# Altium schematic sheet O2 level.SchDoc
size A4; SheetNumber: 1; SheetTotal: 1
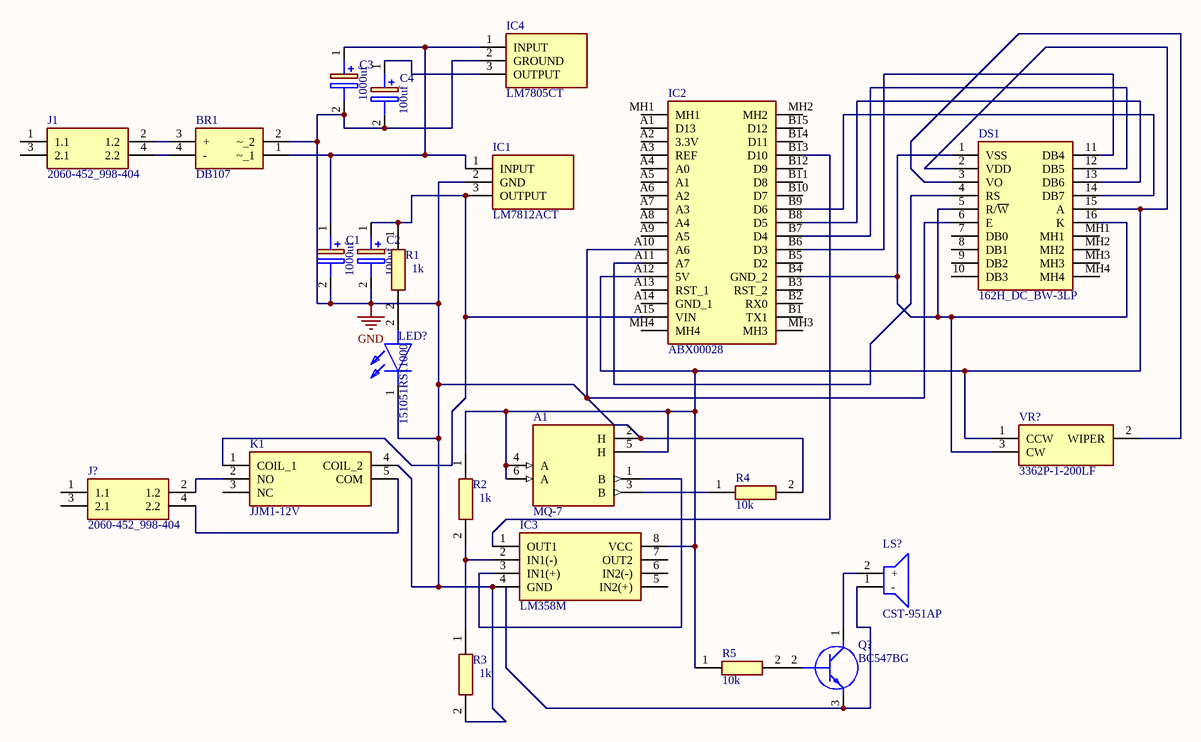
[diagram p0: O2 level.SchDoc]

## Parts
A1  MQ-7  [XDCR_MQ-7]
BR1  DB107  [DIP825W50P510L830H340Q4N]
C1  1000uf  [CAPPRD550W60D1050H2150]
C2  100uf  [CAPPRD500W65D1000H3200]
C3  1000uf  [CAPPRD550W60D1050H2150]
C4  100uf  [CAPPRD500W65D1000H3200]
DS1  162H_DC_BW-3LP  [162HDCBW3LP]
IC1  LM7812ACT  [TO254P470X1016X2019-3P]
IC2  ABX00028  [ABX00028]
IC3  LM358M  [SOIC127P600X175-8N]
IC4  LM7805CT  [TO254P470X1028X1955-3P]
J1  2060-452_998-404  [2060452998404]
J?  2060-452_998-404  [2060452998404]
K1  JJM1-12V  [JJM112V]
LED?  151051RS11000  [151051RS11000]
LS?  CST-951AP  [CST951AP]
Q?  BC547BG  [TO-92_(TO-226)]
R1  1k  [RESAD1987W56L1031D239]
R2  1k  [RESAD1987W56L1031D239]
R3  1k  [RESAD1987W56L1031D239]
R4  10k  [RESAD1987W56L1031D239]
R5  10k  [RESAD1987W56L1031D239]
VR?  3362P-1-200LF  [3362P1200LF]

## Nets
GND: A1.2(H) BR1.2(~_2) C1.2(-) C2.2(-) C3.2(-) C4.2(-) DS1.6(E) IC1.2(GND) IC2.A10(A6) IC3.4(GND) IC4.2(GROUND) K1.4(COIL_2) LED?.1(K) R3.2 R4.2
NetA1_1: A1.1(B) IC3.3(IN1(+))
NetA1_3: A1.3(B) R4.1
NetA1_4: A1.4(A) A1.5(H) A1.6(A) DS1.2(VDD) DS1.15(A) IC2.A12(5V) IC3.8(VCC) R2.1 R5.1 VR?.1(CCW)
NetBR1_1: BR1.1(~_1) C1.1(+) C3.1(+) IC1.1(INPUT) IC4.1(INPUT)
NetBR1_3: BR1.3(+) J1.2(1.2)
NetBR1_4: BR1.4(-) J1.4(2.2)
NetC2_1: C2.1(+) IC1.3(OUTPUT) IC2.A15(VIN) K1.1(COIL_1) R1.1
NetC4_1: C4.1(+) IC4.3(OUTPUT)
NetDS1_1: DS1.1(VSS) DS1.5(R/~{W}) DS1.16(K) IC2.B4(GND_2) VR?.3(CW)
NetDS1_3: DS1.3(VO) VR?.2(WIPER)
NetDS1_4: DS1.4(RS) IC2.A11(A7)
NetDS1_11: DS1.11(DB4) IC2.B6(D3)
NetDS1_12: DS1.12(DB5) IC2.B7(D4)
NetDS1_13: DS1.13(DB6) IC2.B8(D5)
NetDS1_14: DS1.14(DB7) IC2.B9(D6)
NetIC2_B13: IC2.B13(D10) IC3.1(OUT1)
NetIC3_2: IC3.2(IN1(-)) R2.2 R3.1
NetJ?_2: J?.2(1.2) K1.2(NO)
NetJ?_4: J?.4(2.2) K1.5(COM)
NetLED?_2: LED?.2(A) R1.2
NetLS?_1: LS?.1(-) Q?.3(E)
NetLS?_2: LS?.2(+) Q?.1(C)
NetQ?_2: Q?.2(B) R5.2

Not connected (* = marked no-connect by the designer): DS1 7(DB0) 8(DB1) 9(DB2) 10(DB3) MH1 MH2 MH3 MH4; IC2 A1(D13) A2(3.3V) A3(REF) A4(A0) A5(A1) A6(A2) A7(A3) A8(A4) A9(A5) A13(RST_1) A14(GND_1) B1(TX1) B2(RX0) B3(RST_2) B5(D2) B10(D7) B11(D8) B12(D9) B14(D11) B15(D12) MH1 MH2 MH3 MH4; IC3 5(IN2(+)) 6(IN2(-)) 7(OUT2); J1 1(1.1) 3(2.1); J? 1(1.1) 3(2.1); K1 3(NC)

## Library data of the parts
A1 = MQ-7: Gas Sensor, High sensitivity to carbon monoxide; MF: Hanwei Electronics Co., Ltd; Price: None; Availability: Unavailable; MP: MQ-7; Package: Package; SnapEDA_Link: https://www.snapeda.com/parts/MQ-7/Hanwei%20Electronics%20Co.,%20Ltd/view-part/5661821/?ref=snap; Check_prices: https://www.snapeda.com/parts/MQ-7/Hanwei%20Electronics%20Co.,%20Ltd/view-part/5661821/?ref=eda; Value: *
BR1 = DB107: Bridge Rectifier; Manufacturer_Name: Rectron; Datasheet Link: https://www.rectron.com/data_sheets/db101-107.pdf; Height: 3.4mm; Manufacturer_Part_Number: DB107; Mouser Part Number: 583-DB107; Mouser Price/Stock: https://www.mouser.co.uk/ProductDetail/Rectron/DB107?qs=G5AQjGfRJcLGAY%252B6bEDnbw%3D%3D
C1 C3 = 108CKE025M: Capacitor Polarised; Manufacturer_Name: Cinch Connectivity Solutions; Datasheet Link: https://componentsearchengine.com/Datasheets/2/108CKE025M.pdf; Height: 21.5mm; Manufacturer_Part_Number: 108CKE025M
C2 C4 = EEU-FC2A101L: Capacitor Polarised; Manufacturer_Name: Panasonic; Datasheet Link: http://industrial.panasonic.com/cdbs/www-data/pdf/RDF0000/ABA0000C1209.pdf; Height: 32mm; Manufacturer_Part_Number: EEU-FC2A101L; Mouser Part Number: 667-EEU-FC2A101L; Mouser Price/Stock: https://www.mouser.co.uk/ProductDetail/Panasonic/EEU-FC2A101L?qs=MtOUKumLmnYYrYsMGpDvcw%3D%3D; Arrow Part Number: EEU-FC2A101L; Arrow Price/Stock: https://www.arrow.com/en/products/eeu-fc2a101l/panasonic?region=nac
DS1 = 162H_DC_BW-3LP: Display; Manufacturer_Name: Displaytech; Manufacturer_Part_Number: 162H DC BW-3LP; Datasheet Link: https://www.mouser.com/datasheet/2/1015/162H-DC-BW-3LP-Displaytech-Spec-1664822.pdf; Height: 13.2mm; Mouser Part Number: 758-162HDCBW3LP; Mouser Price/Stock: https://www.mouser.co.uk/ProductDetail/Displaytech/162H-DC-BW-3LP?qs=PzGy0jfpSMu9Pu07wP3dWg%3D%3D
IC1 = LM7812ACT: Integrated Circuit; Manufacturer_Name: onsemi; Datasheet Link: https://datasheet.datasheetarchive.com/originals/distributors/Datasheets_SAMA/704b005d7d2d9ced5864f40b6609c1bc.pdf; Height: 4.7mm; Manufacturer_Part_Number: LM7812ACT; Mouser Part Number: 512-LM7812ACT; Mouser Price/Stock: https://www.mouser.com/Search/Refine.aspx?Keyword=512-LM7812ACT; Arrow Part Number: LM7812ACT; Arrow Price/Stock: https://www.arrow.com/en/products/lm7812act/on-semiconductor
IC2 = ABX00028: Integrated Circuit; Manufacturer_Name: Arduino; Datasheet Link: https://store.arduino.cc/arduino-nano-every; Height: 10mm; Manufacturer_Part_Number: ABX00028; Mouser Part Number: 782-ABX00028; Mouser Price/Stock: https://www.mouser.co.uk/ProductDetail/Arduino/ABX00028?qs=PzGy0jfpSMtit6rnFl8mVg%3D%3D; Arrow Part Number: ABX00028; Arrow Price/Stock: https://www.arrow.com/en/products/abx00028/arduino-corporation?region=nac
IC3 = LM358M: Integrated Circuit; Manufacturer_Name: onsemi; Datasheet Link: https://www.onsemi.com/pub/Collateral/LM358A-D.pdf; Height: 1.75mm; Manufacturer_Part_Number: LM358M; Mouser Part Number: 512-LM358M; Mouser Price/Stock: https://www.mouser.co.uk/ProductDetail/onsemi-Fairchild/LM358M?qs=M37yUtvuNLzx7IpRziQN1g%3D%3D; Arrow Part Number: LM358M; Arrow Price/Stock: https://www.arrow.com/en/products/lm358m/on-semiconductor
IC4 = LM7805CT: Integrated Circuit; Manufacturer_Name: Texas Instruments; Datasheet Link: http://www.ti.com/lit/ds/symlink/lm340.pdf; Height: 4.7mm; Manufacturer_Part_Number: LM7805CT; Mouser Part Number: 926-LM7805CT; Mouser Price/Stock: https://www.mouser.co.uk/ProductDetail/Texas-Instruments/LM7805CT?qs=QbsRYf82W3EaqXeMDVwIfQ%3D%3D; Arrow Part Number: LM7805CT; Arrow Price/Stock: https://www.arrow.com/en/products/lm7805ct/texas-instruments?region=europe
J1 J? = 2060-452_998-404: Connector; Manufacturer_Name: Wago; Manufacturer_Part_Number: 2060-452/998-404; Datasheet Link: https://www.wago.com/2060-452/998-404; Height: 4.5mm; Arrow Part Number: 2060-452/998-404; Arrow Price/Stock: https://www.arrow.com/en/products/2060-452998-404/wago-kontakttechnik-gmbh?region=nac
K1 = JJM1-12V: Relay or Contactor; Manufacturer_Name: Panasonic; Datasheet Link: https://www.panasonic-electric-works.com/cps/rde/xbcr/pew_eu_en/ds_61210_en_jjm.pdf; Height: 14.2mm; Manufacturer_Part_Number: JJM1-12V; Mouser Part Number: 769-JJM1-12V; Mouser Price/Stock: https://www.mouser.co.uk/ProductDetail/Panasonic-Industrial-Devices/JJM1-12V?qs=UO%2Fx91QLkSB08I34A9%2FECg%3D%3D; Arrow Part Number: JJM1-12V; Arrow Price/Stock: https://www.arrow.com/en/products/jjm1-12v/panasonic?region=nac
LED? = 151051RS11000: LED; Manufacturer_Name: Wurth Elektronik; Datasheet Link: https://katalog.we-online.com/led/datasheet/151051RS11000.pdf; Height: 13.6mm; Manufacturer_Part_Number: 151051RS11000; Mouser Part Number: 710-151051RS11000; Mouser Price/Stock: https://www.mouser.co.uk/ProductDetail/Wurth-Elektronik/151051RS11000?qs=LlUlMxKIyB0NuMCRBgVmEg%3D%3D
LS? = CST-951AP: Loudspeaker or Buzzer; Manufacturer_Name: CUI Devices; Datasheet Link: https://datasheet.datasheetarchive.com/originals/distributors/Datasheets-45/DSA-14132.pdf; Height: 4.5mm; Manufacturer_Part_Number: CST-951AP; Mouser Part Number: 490-CST-951AP; Mouser Price/Stock: https://www.mouser.co.uk/ProductDetail/CUI-Devices/CST-951AP?qs=WyjlAZoYn50BV9%2FINsWxoA%3D%3D; Arrow Part Number: CST-951AP; Arrow Price/Stock: https://www.arrow.com/en/products/cst-951ap/cui-devices?region=nac
Q? = BC547BG: Transistor BJT NPN; Manufacturer_Name: onsemi; Datasheet Link: https://datasheet.datasheetarchive.com/originals/distributors/Datasheets-23/DSA-455923.pdf; Height: 5.33mm; Manufacturer_Part_Number: BC547BG; Mouser Part Number: N/A; Mouser Price/Stock: http://www.mouser.com/Search/ProductDetail.aspx?qs=NSmgnqlvnz5NIKIycfR5CQ%3d%3d; Arrow Part Number: BC547BG; Arrow Price/Stock: http://www.arrow.com/en/products/bc547bg/on-semiconductor
R1-R5 = RS01A1R000FE12: Resistor; Manufacturer_Name: Vishay; Datasheet Link: http://www.mouser.com/ds/2/427/rsns-226497.pdf; Manufacturer_Part_Number: RS01A1R000FE12; Mouser Part Number: 71-RS01A1R000FE12; Mouser Price/Stock: https://www.mouser.co.uk/ProductDetail/Vishay-Dale/RS01A1R000FE12?qs=pX8%252BLszEE6SqU%2F4VU%252B6gEw%3D%3D; Arrow Part Number: RS01A1R000FE12; Arrow Price/Stock: https://www.arrow.com/en/products/rs01a1r000fe12/vishay?region=nac
VR? = 3362P-1-200LF: Variable Resistor; Manufacturer_Name: Bourns; Datasheet Link: https://www.bourns.com/docs/product-datasheets/3362.pdf; Height: 5.13mm; Manufacturer_Part_Number: 3362P-1-200LF; Mouser Part Number: 652-3362P-1-200LF; Mouser Price/Stock: https://www.mouser.co.uk/ProductDetail/Bourns/3362P-1-200LF?qs=3URE%2FKQzLzdGi9F779EtTA%3D%3D